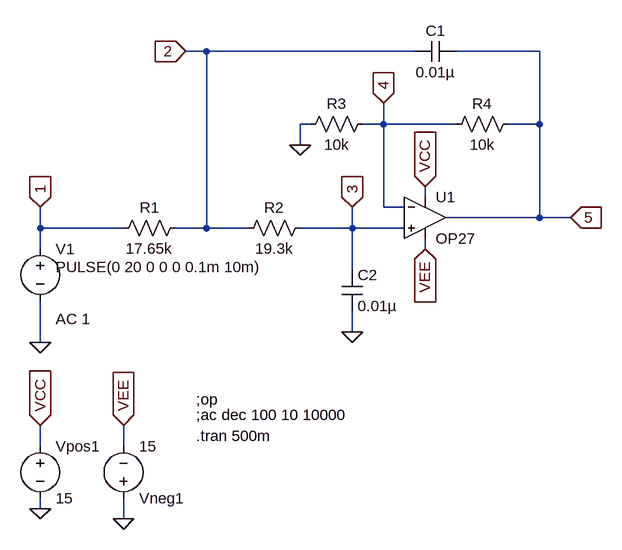
[diagram p0: schematic OpAmp circuit 3.asc]
OpAmp circuit 3.asc, the LTspice schematic file:
Version 4
SHEET 1 1648 964
WIRE 304 -80 272 -80
WIRE 624 -80 304 -80
WIRE 816 -80 688 -80
WIRE 464 32 448 32
WIRE 576 32 576 0
WIRE 576 32 544 32
WIRE 688 32 576 32
WIRE 816 32 816 -80
WIRE 816 32 768 32
WIRE 448 64 448 32
WIRE 640 144 640 128
WIRE 576 160 576 32
WIRE 608 160 576 160
WIRE 816 176 816 32
WIRE 816 176 672 176
WIRE 864 176 816 176
WIRE 48 192 48 160
WIRE 176 192 48 192
WIRE 304 192 304 -80
WIRE 304 192 256 192
WIRE 368 192 304 192
WIRE 528 192 528 160
WIRE 528 192 448 192
WIRE 608 192 528 192
WIRE 48 224 48 192
WIRE 640 224 640 208
WIRE 528 256 528 192
WIRE 528 352 528 320
WIRE 48 368 48 304
WIRE 48 528 48 496
WIRE 176 528 176 496
WIRE 48 624 48 608
WIRE 176 640 176 608
FLAG 48 368 0
FLAG 528 352 0
FLAG 176 640 0
FLAG 48 624 0
FLAG 48 160 1
IOPIN 48 160 In
FLAG 272 -80 2
IOPIN 272 -80 In
FLAG 528 160 3
IOPIN 528 160 In
FLAG 576 0 4
IOPIN 576 0 In
FLAG 864 176 5
IOPIN 864 176 In
FLAG 448 64 0
FLAG 48 496 VCC
IOPIN 48 496 In
FLAG 640 128 VCC
IOPIN 640 128 In
FLAG 640 224 VEE
IOPIN 640 224 In
FLAG 176 496 VEE
IOPIN 176 496 In
SYMBOL voltage 48 208 R0
WINDOW 123 24 124 Left 2
WINDOW 39 0 0 Left 2
WINDOW 3 24 44 Left 2
SYMATTR Value2 AC 1
SYMATTR InstName V1
SYMATTR Value PULSE(0 20 0 0 0 0.1m 10m)
SYMBOL cap 624 -64 R270
WINDOW 0 32 32 VTop 2
WINDOW 3 0 32 VBottom 2
SYMATTR InstName C1
SYMATTR Value 0.01µ
SYMBOL cap 512 256 R0
SYMATTR InstName C2
SYMATTR Value 0.01µ
SYMBOL res 160 208 R270
WINDOW 0 32 56 VTop 2
WINDOW 3 0 56 VBottom 2
SYMATTR InstName R1
SYMATTR Value 17.65k
SYMBOL res 352 208 R270
WINDOW 0 32 56 VTop 2
WINDOW 3 0 56 VBottom 2
SYMATTR InstName R2
SYMATTR Value 19.3k
SYMBOL res 448 48 R270
WINDOW 0 32 56 VTop 2
WINDOW 3 0 56 VBottom 2
SYMATTR InstName R3
SYMATTR Value 10k
SYMBOL res 672 48 R270
WINDOW 0 32 56 VTop 2
WINDOW 3 0 56 VBottom 2
SYMATTR InstName R4
SYMATTR Value 10k
SYMBOL Opamps\\OP27 640 112 R0
SYMATTR InstName U1
SYMBOL voltage 176 624 M180
WINDOW 123 0 0 Left 2
WINDOW 39 0 0 Left 2
SYMATTR InstName Vneg1
SYMATTR Value 15
SYMBOL voltage 48 512 R0
WINDOW 123 0 0 Left 2
WINDOW 39 0 0 Left 2
SYMATTR InstName Vpos1
SYMATTR Value 15
TEXT 288 456 Left 2 !;op
TEXT 288 480 Left 2 !;ac dec 100 10 10000
TEXT 288 512 Left 2 !.tran 500m

The netlist it stands for:
* OpAmp circuit 3.asc
V1 1 0 PULSE(0 20 0 0 0 0.1m 10m) AC 1
C1 2 5 0.01µ
C2 3 0 0.01µ
R1 1 2 17.65k
R2 2 3 19.3k
R3 0 4 10k
R4 4 5 10k
XU1 3 4 VCC VEE 5 OP27  ; pins In+ In- V+ V- OUT
Vneg1 0 VEE 15
Vpos1 VCC 0 15
;op
;ac dec 100 10 10000
.tran 500m
.lib ADI.lib
.backanno
.end